# Altium schematic sheet BI1.SchDoc
size 420 x 297 mm; DocumentNumber: 6; SheetNumber: 6; SheetTotal: 13; DecimalNumber: СНАБ.468222.001 ЭЗ
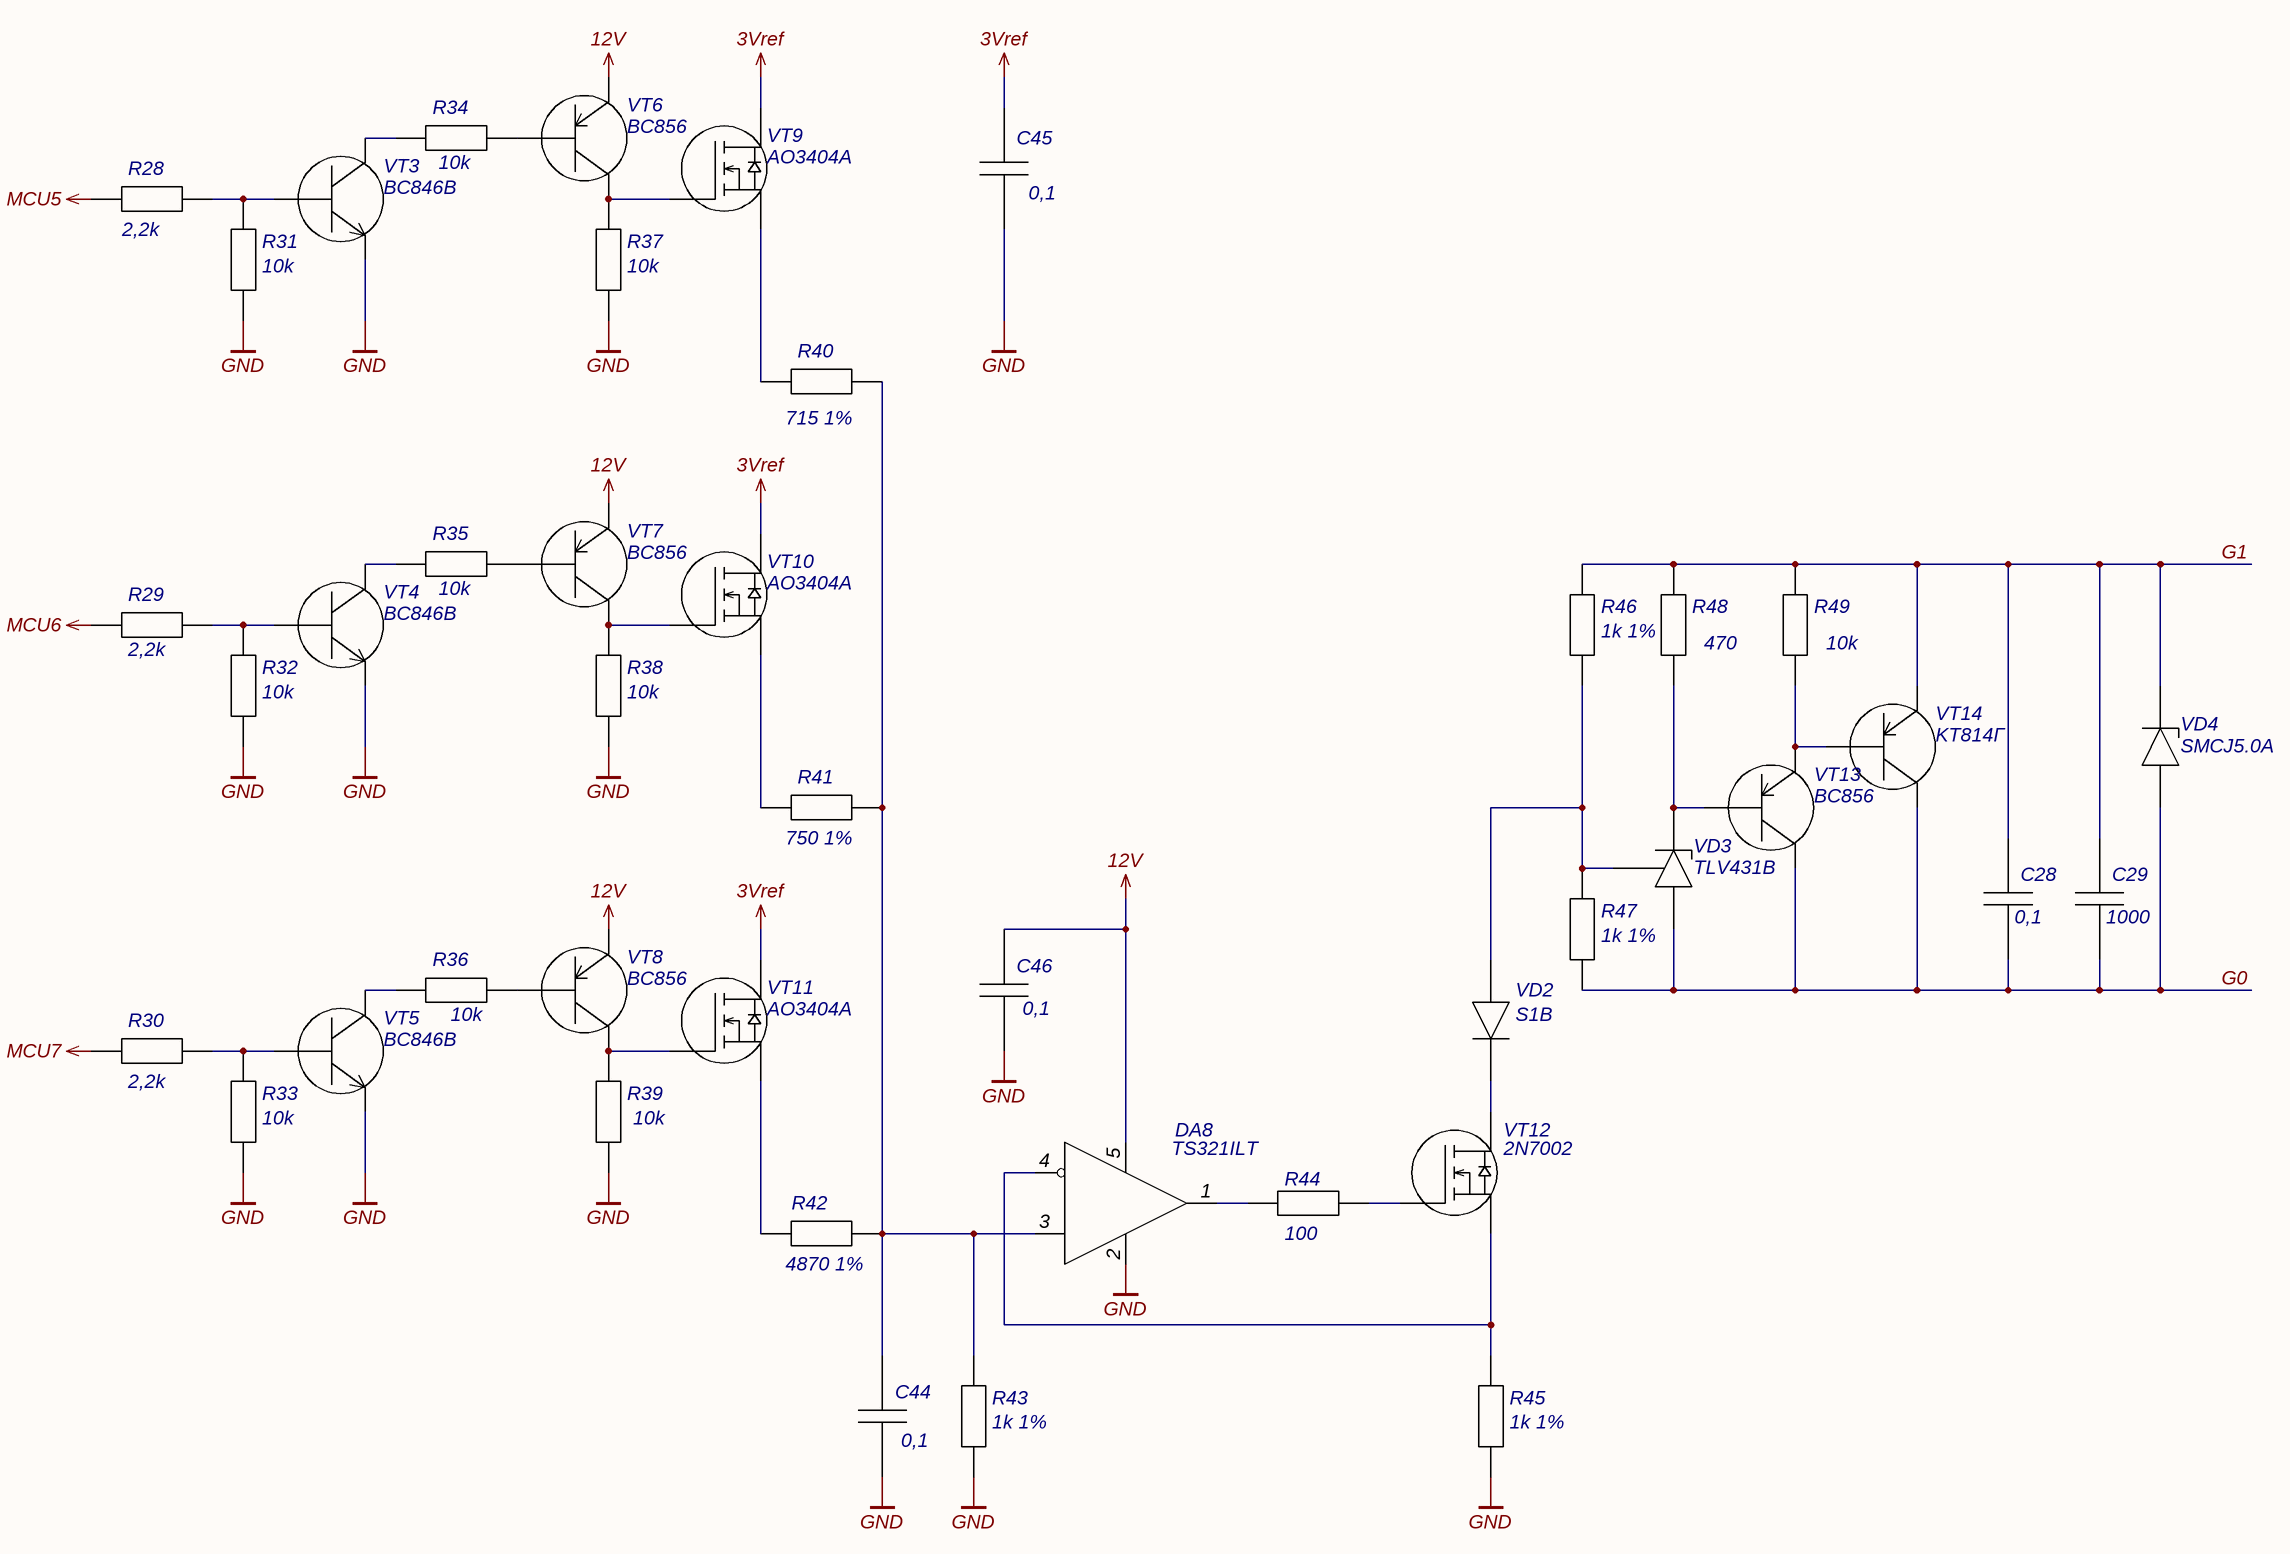
[diagram p0: BI1.SchDoc]

## Parts
C28  0,1  [C0603]
C29  1000  [C0603]
C44  0,1  [C0603]
C45  0,1  [C0603]
C46  0,1  [C0603]
DA8  TS321ILT  [SOT-23-5]
R28  2,2k  [R0603]
R29  2,2k  [R0603]
R30  2,2k  [R0603]
R31  10k  [R0603]
R32  10k  [R0603]
R33  10k  [R0603]
R34  10k  [R0603]
R35  10k  [R0603]
R36  10k  [R0603]
R37  10k  [R0603]
R38  10k  [R0603]
R39  10k  [R0603]
R40  715 1%  [R0603]
R41  750 1%  [R0603]
R42  4870 1%  [R0603]
R43  1k 1%  [R0603]
R44  100  [R0603]
R45  1k 1%  [R0603]
R46  1k 1%  [R0603]
R47  1k 1%  [R0603]
R48  470  [R0603]
R49  10k  [R0603]
VD2  S1B  [DO-214AC]
VD3  TLV431B  [SOT-23]
VD4  SMCJ5.0A  [DO-214AB]
VT3  BC846B  [SOT-23]
VT4  BC846B  [SOT-23]
VT5  BC846B  [SOT-23]
VT6  BC856  [SOT-23]
VT7  BC856  [SOT-23]
VT8  BC856  [SOT-23]
VT9  AO3404A  [SOT-23]
VT10  AO3404A  [SOT-23]
VT11  AO3404A  [SOT-23]
VT12  2N7002  [SOT-23]
VT13  BC856  [SOT-23]
VT14  KT814Г  [TO-126]

## Nets
3Vref: C45.2 VT9.2(D) VT10.2(D) VT11.2(D)
12V: C46.2 DA8.5(Vcc) VT6.1 VT7.1 VT8.1
GND: C44.1 C45.1 C46.1 DA8.2(GND) R31.1 R32.1 R33.1 R37.1 R38.1 R39.1 R43.1 R45.1 VT3.2(E) VT4.2(E) VT5.2(E)
MCU5: R28.1
MCU6: R29.1
MCU7: R30.1
G0: C28.1 C29.1 R47.1 VD3.1 VD4.1 VT13.2 VT14.2
G1: C28.2 C29.2 R46.2 R48.2 R49.2 VD4.2 VT14.1
NetC44_2: C44.2 DA8.3(+) R40.2 R41.2 R42.2 R43.2
NetDA8_1: DA8.1(OUT) R44.1
NetDA8_4: DA8.4(-) R45.2 VT12.3(S)
NetR28_2: R28.2 R31.2 VT3.1(B)
NetR29_2: R29.2 R32.2 VT4.1(B)
NetR30_2: R30.2 R33.2 VT5.1(B)
NetR34_1: R34.1 VT3.3(C)
NetR34_2: R34.2 VT6.3
NetR35_1: R35.1 VT4.3(C)
NetR35_2: R35.2 VT7.3
NetR36_1: R36.1 VT5.3(C)
NetR36_2: R36.2 VT8.3
NetR37_2: R37.2 VT6.2 VT9.1(G)
NetR38_2: R38.2 VT7.2 VT10.1(G)
NetR39_2: R39.2 VT8.2 VT11.1(G)
NetR40_1: R40.1 VT9.3(S)
NetR41_1: R41.1 VT10.3(S)
NetR42_1: R42.1 VT11.3(S)
NetR44_2: R44.2 VT12.1(G)
NetR46_1: R46.1 R47.2 VD2.1 VD3.3
NetR48_1: R48.1 VD3.2 VT13.3
NetR49_1: R49.1 VT13.1 VT14.3
NetVD2_2: VD2.2 VT12.2(D)

## Notes on the sheet
- Подп. и дата
- Инв.№ дубл.
- Взам.инв.№
- Подп.и дата
- Инв.№ подл.
- Изм.
- Лист
- № докум.
- Подп.
- Дата
- Копировал
- Формат  A3

## Library data of the parts
C28 C29 C44-C46 = Chip Capasitor: Чип-конденсатор
  C28 C44-C46: Value: 0,1
  C29: Value: 1000
DA8 = TS321ILT: 1х Операционный усилитель; Manufacurer: STMicroelectronics; Case: SOT-23-5; Name: TS321ILT; Datasheet: https://static.chipdip.ru/lib/710/DOC011710227.pdf
R28-R39 R44 R48 R49 = Chip Resistor: Чип-резистор
  R28-R30: Value: 2,2k
  R31-R39 R49: Value: 10k
  R44: Value: 100
  R48: Value: 470
R40 = Chip Resistor: Чип-резистор; Partnumber: RC0603FR-07715RL; Value: 715 1%; URL: https://www.chipdip.ru/product0/8002000768
R41 = Chip Resistor: Чип-резистор; Partnumber: RC0603FR-07750RL; Value: 750 1%; URL: https://www.chipdip.ru/product/0.1w-0603-750-om-1
R42 = Chip Resistor: Чип-резистор; Partnumber: RC0603FR-074K87L; Value: 4870 1%; URL: https://www.chipdip.ru/product0/8002000679
R43 R45-R47 = Chip Resistor: Чип-резистор; Partnumber: CRCW06031K00FKEAC; Value: 1k 1%; URL: https://www.chipdip.ru/product0/8002019285
VD2 = S1B: Диод выпрямительный, 100В; Manufacturer: Diotec Semiconductor; Case: DO-214AC; Name: S1B; Datasheet: https://static.chipdip.ru/lib/113/DOC032113174.pdf
VD3 = TLV431B: Стабилитрон регулируемый, 6В; Manufacturer: Texas Instruments; Case: SOT-23; Name: TLV431B; Datasheet: https://static.chipdip.ru/lib/985/DOC012985043.pdf
VD4 = SMCJ5.0A: Защитный диод, 5В; Manufacturer: UTD Semiconductor Co.,Ltd; Case: DO-201; Name: SMCJ5.0A; Datasheet: https://static.chipdip.ru/lib/863/DOC025863760.pdf
VT3-VT5 = BC846B: Транзистор биполярный NPN, 65В; Manufacturer: Nexperia B.V.; Case: SOT-23; Name: BC846B; Datasheet: https://static.chipdip.ru/lib/551/DOC012551042.pdf
VT6-VT8 VT13 = BC856: Транзистор биполярный PNP, 65В; Manufacturer: Nexperia; Case: SOT-23; Name: BC856; Datasheet: https://static.chipdip.ru/lib/365/DOC004365998.pdf
VT9-VT11 = AO3404A: Транзистор MOSFET N-канал, 30В; Manufacturer: UTD Semiconductor Co.,Ltd; Case: SOT-23; Name: AO3404A; Datasheet: https://static.chipdip.ru/lib/906/DOC012906979.pdf
VT12 = 2N7002: Транзистор MOSFET N-канал, 60В; Manufacturer: UTD Semiconductor Co.; Case: SOT-23; Name: 2N7002; Datasheet: https://static.chipdip.ru/lib/301/DOC021301072.pdf
VT14 = KT814Г: Транзистор биполярный PNP, 100В; Manufacturer: АО «ГРУППА КРЕМНИЙ ЭЛ»; TU: аАО.336.184 ТУ/02; Case: TO-126; Name: KT814Г; Datasheet: https://static.chipdip.ru/lib/404/DOC047404057.pdf